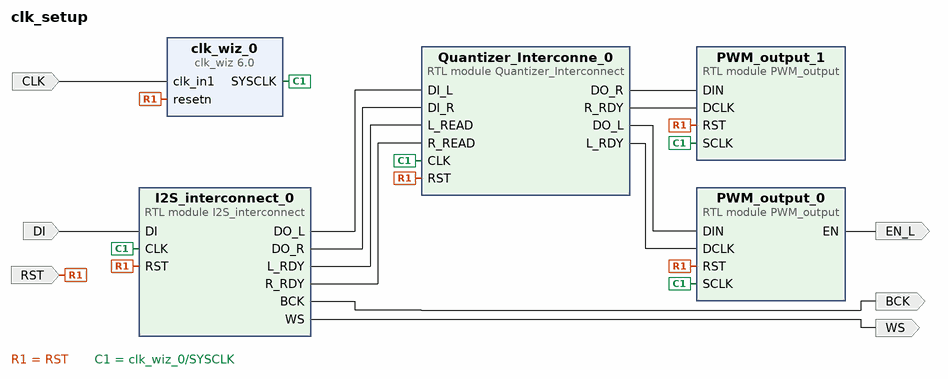
[diagram p0: block diagram of the top level]
# Vivado block design clk_setup, xc7a35tftg256-2, Vivado 2024.2
create_bd_design clk_setup

create_bd_port -dir I -type clk CLK
set_property -dict {CONFIG.FREQ_HZ 100000000} [get_bd_ports CLK]
create_bd_port -dir O -type data EN_L
create_bd_port -dir I -type data DI
create_bd_port -dir O WS
create_bd_port -dir O BCK
create_bd_port -dir I -type rst RST

create_bd_cell -type ip -vlnv xilinx.com:ip:clk_wiz:6.0 clk_wiz_0
set_property -dict [list \
  CONFIG.CLKOUT1_JITTER 226.571 \
  CONFIG.CLKOUT1_PHASE_ERROR 296.014 \
  CONFIG.CLKOUT1_REQUESTED_OUT_FREQ 90.316800 \
  CONFIG.CLKOUT2_JITTER 123.670 \
  CONFIG.CLKOUT2_PHASE_ERROR 92.672 \
  CONFIG.CLKOUT2_REQUESTED_OUT_FREQ 100.000 \
  CONFIG.CLKOUT2_USED false \
  CONFIG.CLKOUT3_JITTER 123.670 \
  CONFIG.CLKOUT3_PHASE_ERROR 92.672 \
  CONFIG.CLKOUT3_USED false \
  CONFIG.CLK_OUT1_PORT SYSCLK \
  CONFIG.CLK_OUT2_PORT clk_out2 \
  CONFIG.MMCM_CLKFBOUT_MULT_F 53.625 \
  CONFIG.MMCM_CLKOUT0_DIVIDE_F 11.875 \
  CONFIG.MMCM_CLKOUT1_DIVIDE 1 \
  CONFIG.MMCM_CLKOUT2_DIVIDE 1 \
  CONFIG.MMCM_DIVCLK_DIVIDE 5 \
  CONFIG.NUM_OUT_CLKS 1 \
  CONFIG.RESET_PORT resetn \
  CONFIG.RESET_TYPE ACTIVE_LOW \
] [get_bd_cells clk_wiz_0]
create_bd_cell -type module -reference I2S_interconnect I2S_interconnect_0
create_bd_cell -type module -reference PWM_output PWM_output_0
create_bd_cell -type module -reference PWM_output PWM_output_1
create_bd_cell -type module -reference Quantizer_Interconnect Quantizer_Interconne_0

# ---- connections ----

connect_bd_net [get_bd_ports CLK] [get_bd_pins clk_wiz_0/clk_in1]
connect_bd_net [get_bd_ports DI] [get_bd_pins I2S_interconnect_0/DI]
connect_bd_net [get_bd_pins I2S_interconnect_0/BCK] [get_bd_ports BCK]
connect_bd_net [get_bd_pins I2S_interconnect_0/DO_L] [get_bd_pins Quantizer_Interconne_0/DI_L]
connect_bd_net [get_bd_pins I2S_interconnect_0/DO_R] [get_bd_pins Quantizer_Interconne_0/DI_R]
connect_bd_net [get_bd_pins I2S_interconnect_0/L_RDY] [get_bd_pins Quantizer_Interconne_0/L_READ]
connect_bd_net [get_bd_pins I2S_interconnect_0/R_RDY] [get_bd_pins Quantizer_Interconne_0/R_READ]
connect_bd_net [get_bd_pins I2S_interconnect_0/WS] [get_bd_ports WS]
connect_bd_net [get_bd_ports RST] \
  [get_bd_pins clk_wiz_0/resetn] [get_bd_pins I2S_interconnect_0/RST] [get_bd_pins Quantizer_Interconne_0/RST] \
  [get_bd_pins PWM_output_0/RST] [get_bd_pins PWM_output_1/RST]
connect_bd_net [get_bd_pins PWM_output_0/EN] [get_bd_ports EN_L]
connect_bd_net [get_bd_pins Quantizer_Interconne_0/DO_L] [get_bd_pins PWM_output_0/DIN]
connect_bd_net [get_bd_pins Quantizer_Interconne_0/DO_R] [get_bd_pins PWM_output_1/DIN]
connect_bd_net [get_bd_pins Quantizer_Interconne_0/L_RDY] [get_bd_pins PWM_output_0/DCLK]
connect_bd_net [get_bd_pins Quantizer_Interconne_0/R_RDY] [get_bd_pins PWM_output_1/DCLK]
connect_bd_net [get_bd_pins clk_wiz_0/SYSCLK] \
  [get_bd_pins I2S_interconnect_0/CLK] [get_bd_pins Quantizer_Interconne_0/CLK] [get_bd_pins PWM_output_0/SCLK] \
  [get_bd_pins PWM_output_1/SCLK]

validate_bd_design
save_bd_design
